# EAGLE design carbsync (EAGLE 7.2.0)
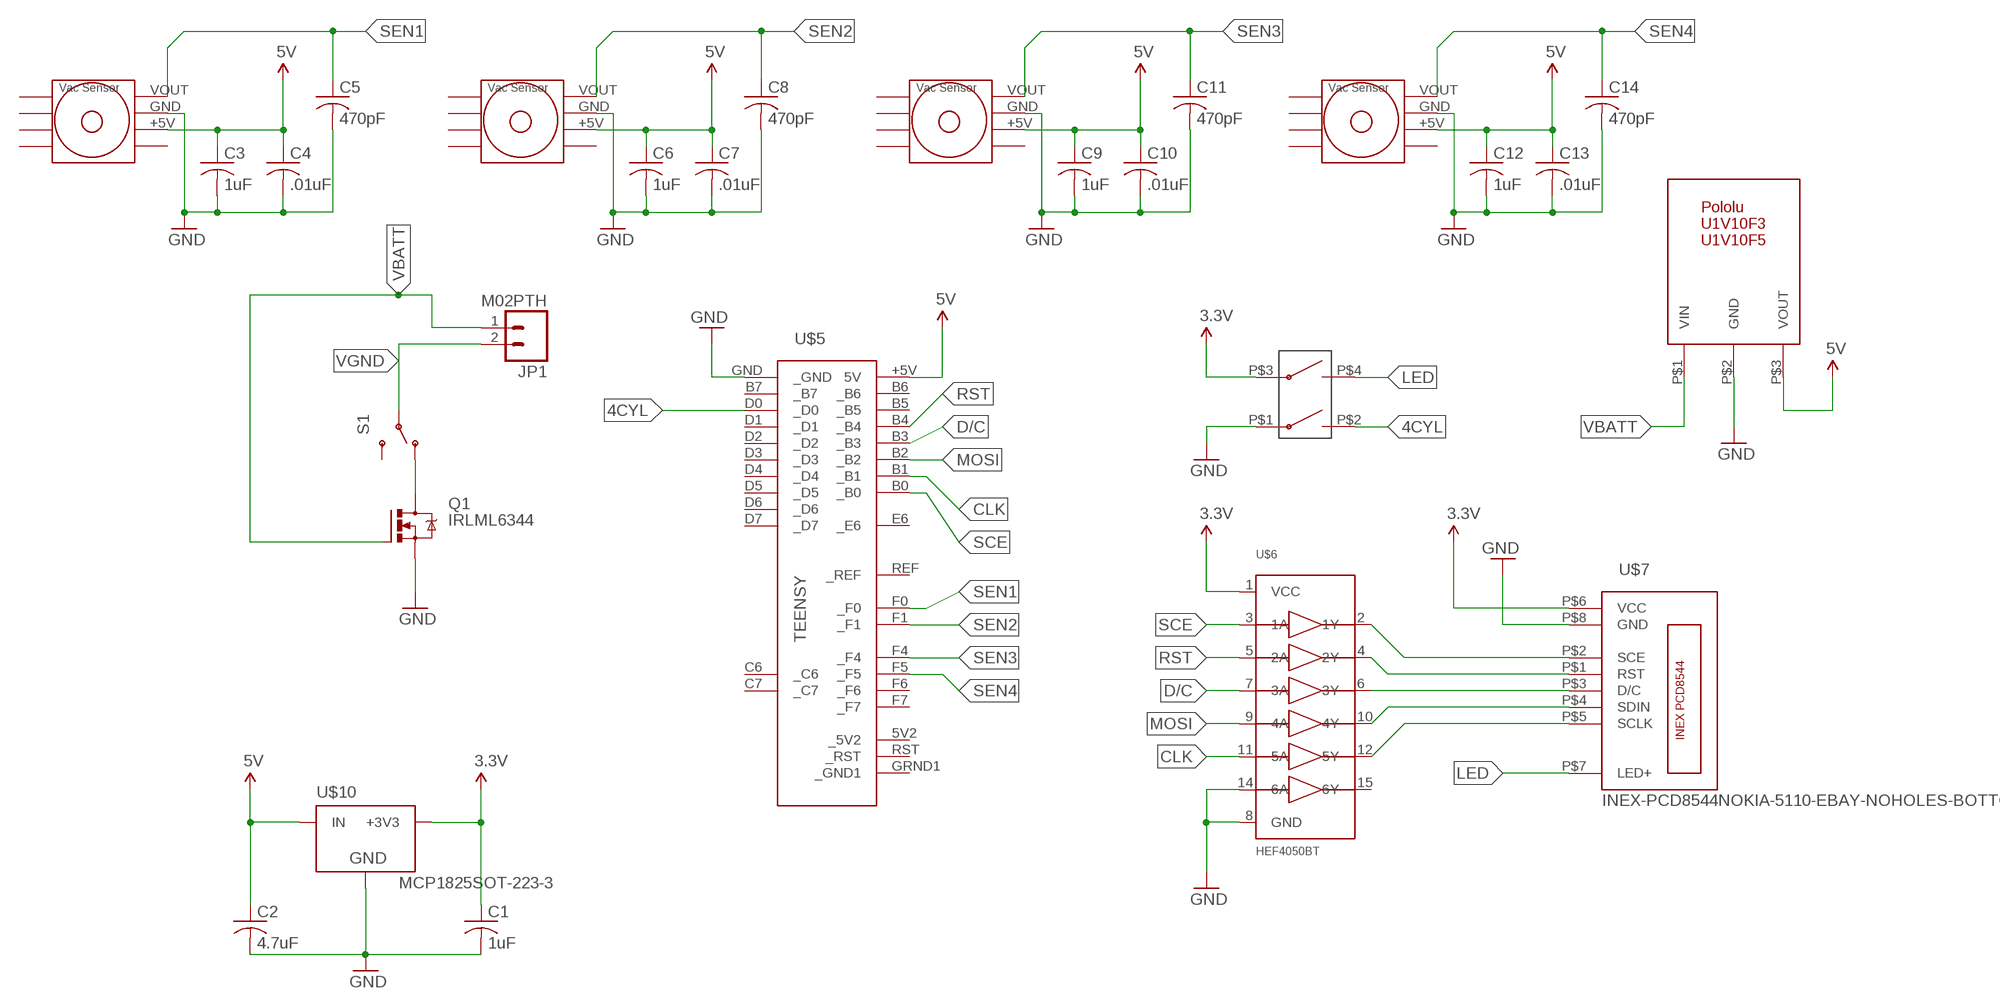
[diagram p0: schematic, sheet 1]

## Parts
C1  1uF  C-USC0805  [C0805]
C2  4.7uF  C-USC0805  [C0805]
C3  1uF  C-USC0805  [C0805]
C4  .01uF  C-USC0805  [C0805]
C5  470pF  C-USC0603  [C0603]
C6  1uF  C-USC0805  [C0805]
C7  .01uF  C-USC0805  [C0805]
C8  470pF  C-USC0603  [C0603]
C9  1uF  C-USC0805  [C0805]
C10  .01uF  C-USC0805  [C0805]
C11  470pF  C-USC0603  [C0603]
C12  1uF  C-USC0805  [C0805]
C13  .01uF  C-USC0805  [C0805]
C14  470pF  C-USC0603  [C0603]
JP1  M02PTH  [1X02]
Q1  IRLML6344  [SOT23]
S1  SWITCH-SPDT  [CWI286-SPDT-NOTABS]
U$1  MPXV5050V  [MPXV5050V]
U$2  MPXV5050V  [MPXV5050V]
U$3  MPXV5050V  [MPXV5050V]
U$4  MPXV5050V  [MPXV5050V]
U$5  TEENSY  [TEENSY]
U$6  HEF4050BT  74HC4050D  [SOIC16]
U$7  INEX-PCD8544NOKIA-5110-EBAY-NOHOLES-BOTTOM  [NOKIA-5110-EBAY-NOHOLES]
U$8  POLOLU-DC-3PINU1V10F5-5V-DC-UP  [POLOLU-DC-3PIN]
U$9  CT-219-X-MST  [CT219-2-MST]
U$10  MCP1825SOT-223-3  [SOT-223]

## Nets
3.3V: C1.1 U$6.1(VCC) U$7.P$6(VCC) U$9.P$3 U$10.3(+3V3)
4CYL: U$5.D0(_D0) U$9.P$2
5V: C2.1 C3.1 C4.1 C6.1 C7.1 C9.1 C10.1 C12.1 C13.1 U$1.+5V(5V) U$2.+5V(5V) U$3.+5V(5V) U$4.+5V(5V) U$5.+5V(5V) U$8.P$3(VOUT) U$10.1(IN)
CLK: U$5.B1(_B1) U$6.11(5A)
D/C: U$5.B3(_B3) U$6.7(3A)
GND: C1.2 C2.2 C3.2 C4.2 C5.2 C6.2 C7.2 C8.2 C9.2 C10.2 C11.2 C12.2 C13.2 C14.2 Q1.2(S) U$1.GND U$2.GND U$3.GND U$4.GND U$5.GND(_GND) U$6.8(GND) U$6.14(6A) U$7.P$8(GND) U$8.P$2(GND) U$9.P$1 U$10.2(GND) U$10.4(GND)
LED: U$7.P$7(LED+) U$9.P$4
MOSI: U$5.B2(_B2) U$6.9(4A)
N$1: U$6.2(1Y) U$7.P$2(SCE)
N$2: U$6.4(2Y) U$7.P$1(RST)
N$3: U$6.6(3Y) U$7.P$3(D/C)
N$4: U$6.10(4Y) U$7.P$4(SDIN)
N$5: U$6.12(5Y) U$7.P$5(SCLK)
N$6: Q1.3(D) S1.P$1(O)
RST: U$5.B4(_B4) U$6.5(2A)
SCE: U$5.B0(_B0) U$6.3(1A)
SEN1: C5.1 U$1.VOUT U$5.F0(_F0)
SEN2: C8.1 U$2.VOUT U$5.F1(_F1)
SEN3: C11.1 U$3.VOUT U$5.F4(_F4)
SEN4: C14.1 U$4.VOUT U$5.F5(_F5)
VBATT: JP1.1 Q1.1(G) U$8.P$1(VIN)
VGND: JP1.2 S1.P$2(P)
Unconnected: S1.P$3(S) U$1.P$1 U$1.P$5 U$1.P$6 U$1.P$7 U$1.P$8 U$2.P$1 U$2.P$5 U$2.P$6 U$2.P$7 U$2.P$8 U$3.P$1 U$3.P$5 U$3.P$6 U$3.P$7 U$3.P$8 U$4.P$1 U$4.P$5 U$4.P$6 U$4.P$7 U$4.P$8 U$5.5V2(_5V2) U$5.B5(_B5) U$5.B6(_B6) U$5.B7(_B7) U$5.C6(_C6) U$5.C7(_C7) U$5.D1(_D1) U$5.D2(_D2) U$5.D3(_D3) U$5.D4(_D4) U$5.D5(_D5) U$5.D6(_D6) U$5.D7(_D7) U$5.E6(_E6) U$5.F6(_F6) U$5.F7(_F7) U$5.GRND1(_GND1) U$5.REF(_REF) U$5.RST(_RST) U$6.15(6Y)

## Library data of the parts
C1-C14 = resistor:C-US: CAPACITOR, American symbol
JP1 = SparkFun-Connectors:M02: Standard 2-pin 0.1" header. Use with - straight break away headers ( PRT-00116) - right angle break away headers (PRT-00553) - swiss pins (PRT-00743) - machine pins (PRT-00117) - female headers (PRT-00115) Molex polarized connector foot print use with: PRT-08233 with associated crimp pins and housings. 2.54_SCREWTERM for use with PRT-10571. 3.5mm Screw Terminal footprints for PRT-08084 5mm Screw Terminal footprints for use with PRT-08433
Q1 = synfinatic:IRLML6344: N-CHANNEL MOS FET
S1 = synfinatic:SWITCH-SPDT: SPDT Switch Simple slide switch, Spark Fun Electronics SKU : COM-00102 DPDT SMT slide switch, AYZ0202, SWCH-08179
U$1-U$4 = synfinatic:MPXV5050V: Freescale Semiconductor MPXV5050VC6T1 Rev 2, 11/2009 Pressure High Temperature Accuracy Integrated Silicon Pressure Sensor for Measuring Absolute Pressure, On-Chip Signal Conditioned, Temperature Compensated and Calibrated
U$5 = teensy:TEENSY: Teensy 2.0 Original Design by Clint Fisher Modified Design by Tamir Emran Licensed Under Creative Commons Attribution-ShareAlike 3.0 Unported (CC BY-SA 3.0)
U$6 = microbuilder:74HC4050D: 6-channel level shifter 74HC4050D - 2V-6V Supply Digikey: 74HC4050D,653-ND Mouser: 771-74HC4050D-T
U$7 = synfinatic:INEX-PCD8544: INEX PCD8544 LCD Basically a Nokia 5110 LCD with 8 pins. Available at Robotshop.com Note that this PCB has two sets of contacts, top has pins, the bottom has through-hole pads. If you want to use the pads on the bottom, use the alternate package
U$8 = synfinatic:POLOLU-DC-3PIN: Pololu 5V Step-Up Voltage Regulator U1V10F5 Pololu 3.3V Step-Up Voltage Regulator U1V10F3
U$9 = synfinatic:CT-219-X-MST
U$10 = synfinatic:MCP1825: MCP1825 3.3v LDO Linear Regulator

## Board
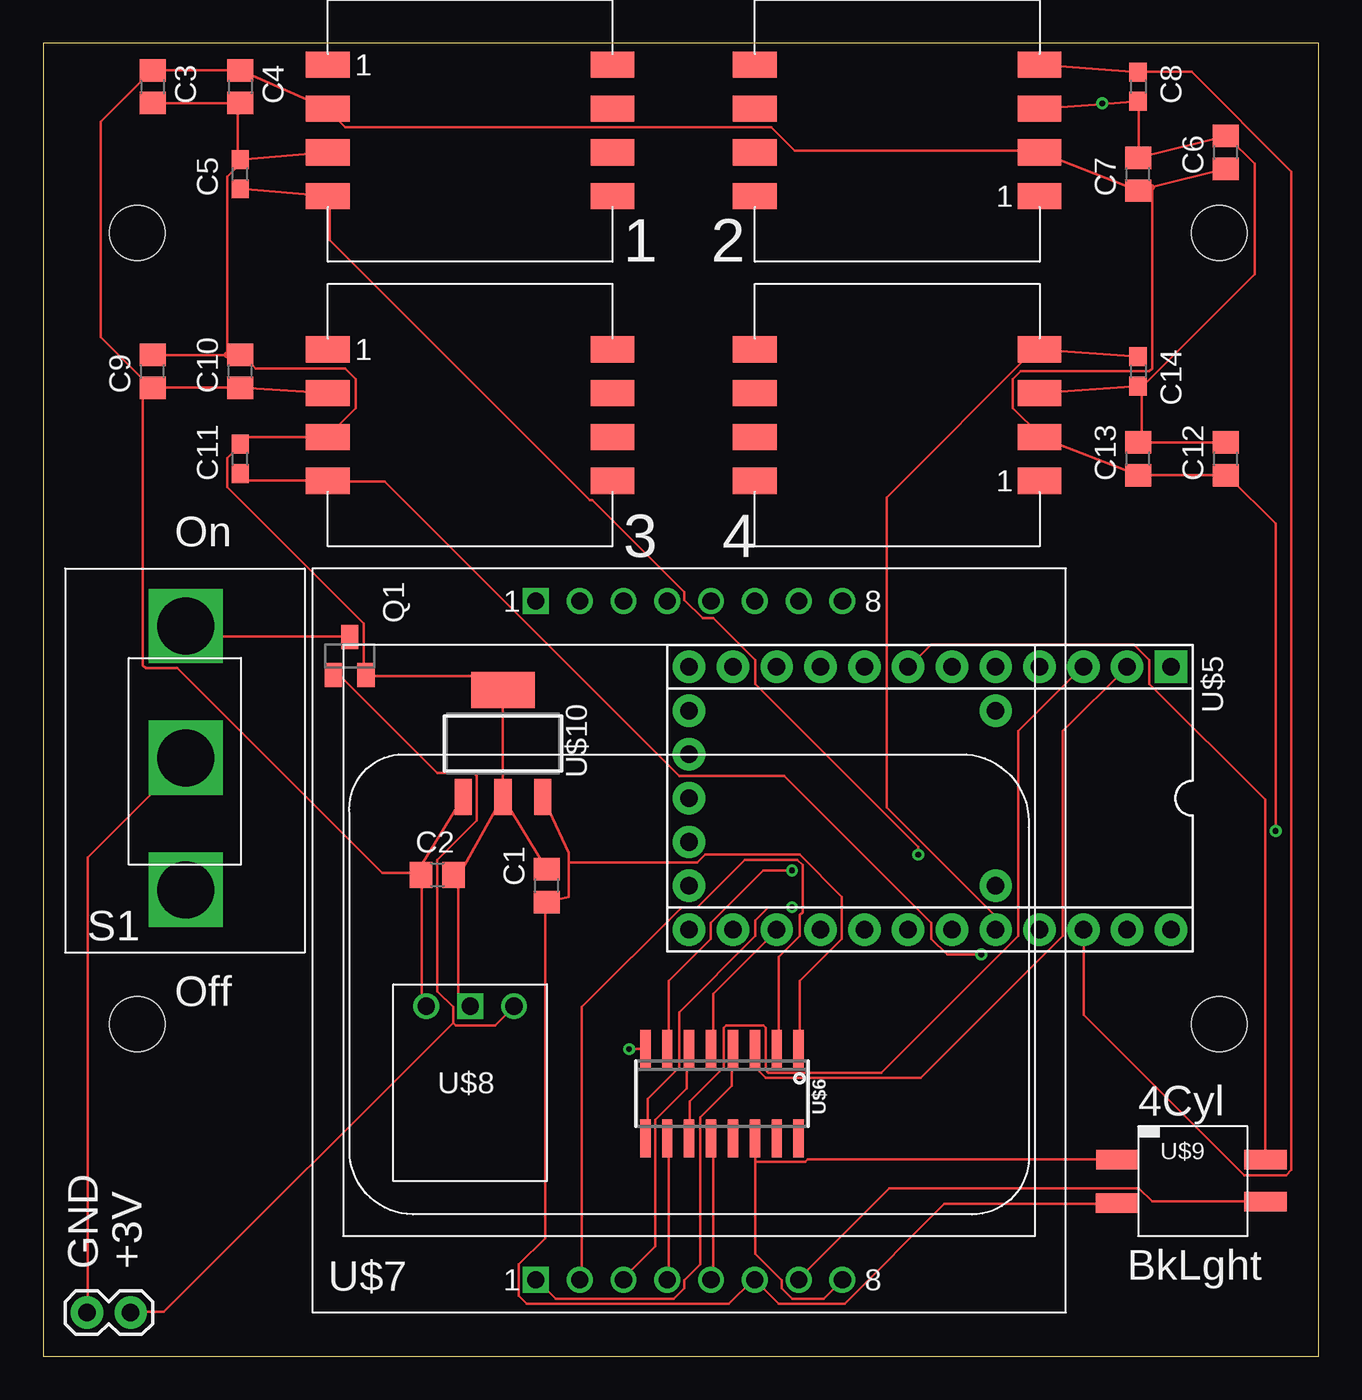
[diagram p1: board, top side]
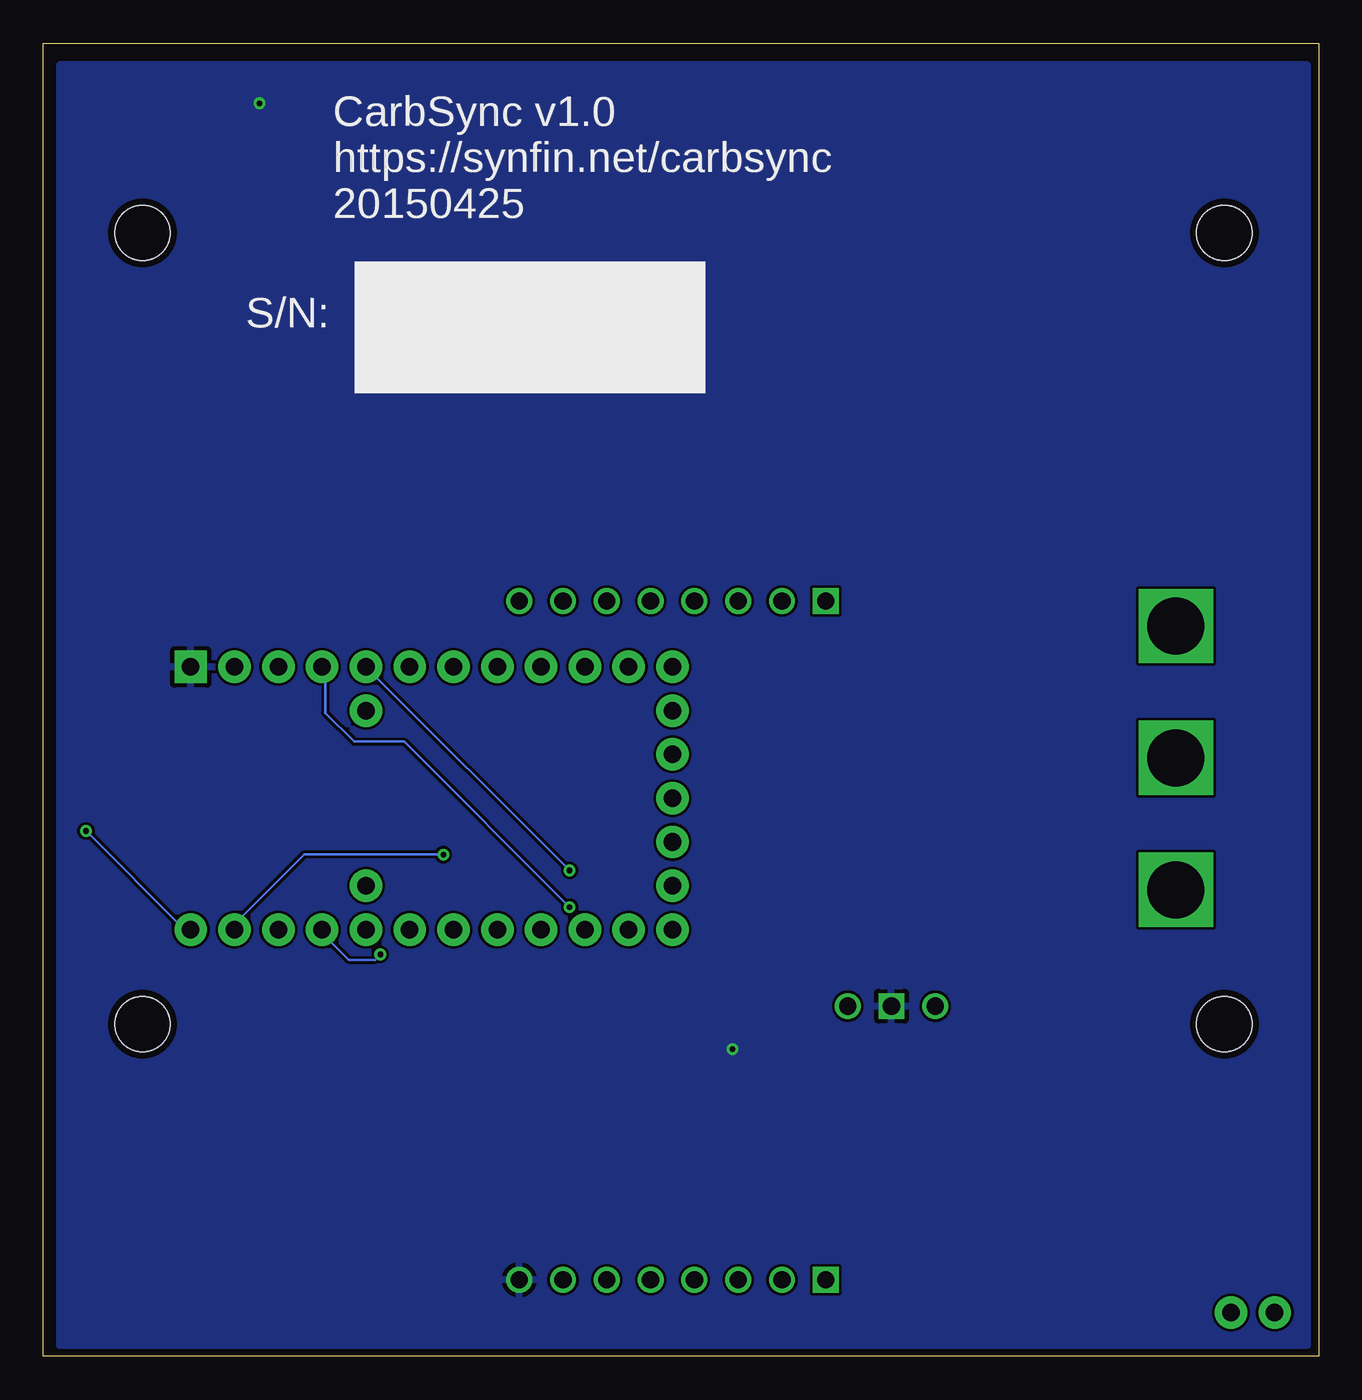
[diagram p2: board, bottom side, seen from below]

Size 73.97 x 76.19 mm. Coordinates in mm from the lower left corner, seen from the top.
Outline: 0,0 73.97,0 73.97,76.19 0,76.19 0,0
Copper layers (1*16): Top 0.0356mm / dielectric 1.5011mm / Bottom 0.0356mm
Design rules "LaenPCBOrder": minimum track width 6mil, minimum drill 13mil, track to track 6mil, track to pad 6mil, pad to pad 6mil, via to via 6mil, smd to smd 6mil, copper to edge 15mil, drill to drill 6mil, minimum pad ring 7mil, minimum via ring 7mil, stop-mask expansion 4mil, vias tented up to drill 0mil, thermal gap 10mil
Holes 3.2 mm at 5.46,19.28 68.2,19.28 68.2,65.18 5.46,65.18

### Footprints (pad centres in the part's own frame; a part is rotated, then mirrored left to right if it is on the bottom)
C0805 = smd 1.3 x 1.5: 1 -0.95,0; 2 0.95,0
C0603 = smd 1.1 x 1: 1 -0.85,0; 2 0.85,0
1X02 = drill 1.016 pad 1.88: 1 0,0; 2 2.54,0
SOT23 = smd 1 x 1.4: 1 -0.95,-1.1; 2 0.95,-1.1; 3 0,1.1
CWI286-SPDT-NOTABS = drill 3.3 square: P$1 3.35,7; P$2 11,7; P$3 18.65,7
MPXV5050V = smd 2.54 x 1.52: +5V 8.255,-1.27; GND 8.255,1.27; P$1 8.255,-3.81; P$5 -8.255,3.81; P$6 -8.255,1.27; P$7 -8.255,-1.27; P$8 -8.255,-3.81; VOUT 8.255,3.81
TEENSY = drill 1.016 pad 1.88: 5V2 13.97,-2.54; +5V -13.97,7.62; B0 -11.43,-7.62; B1 -8.89,-7.62; B2 -6.35,-7.62; B3 -3.81,-7.62; B4 8.89,7.62; B5 6.35,7.62; B6 3.81,7.62; B7 -1.27,-7.62; C6 11.43,-7.62; C7 13.97,-7.62; D0 1.27,-7.62; D1 3.81,-7.62; D2 6.35,-7.62; D3 8.89,-7.62; D4 13.97,5.08; D5 13.97,-5.08; D6 13.97,7.62; D7 11.43,7.62; E6 -3.81,-5.08; F0 -11.43,7.62; F1 -8.89,7.62; F4 -6.35,7.62; F5 -3.81,7.62; F6 -1.27,7.62; F7 1.27,7.62; GRND1 13.97,0; REF -3.81,5.08; RST 13.97,2.54 | drill 1.016 pad 1.88 square: GND -13.97,-7.62
SOIC16 = smd 0.6 x 2.2: 1 -4.445,-2.6; 2 -3.175,-2.6; 3 -1.905,-2.6; 4 -0.635,-2.6; 5 0.635,-2.6; 6 1.905,-2.6; 7 3.175,-2.6; 8 4.445,-2.6; 9 4.445,2.6; 10 3.175,2.6; 11 1.905,2.6; 12 0.635,2.6; 13 -0.635,2.6; 14 -1.905,2.6; 15 -3.175,2.6; 16 -4.445,2.6
NOKIA-5110-EBAY-NOHOLES = drill 1 square: P$1 -8.89,-15.875; P$9 -8.89,23.495 | drill 1: P$2 -6.35,-15.875; P$3 -3.81,-15.875; P$4 -1.27,-15.875; P$5 1.27,-15.875; P$6 3.81,-15.875; P$7 6.35,-15.875; P$8 8.89,-15.875; P$10 -6.35,23.495; P$11 -3.81,23.495; P$12 -1.27,23.495; P$13 1.27,23.495; P$14 3.81,23.495; P$15 6.35,23.495; P$16 8.89,23.495
POLOLU-DC-3PIN = drill 1: P$1 1.905,1.27; P$3 6.985,1.27 | drill 1 square: P$2 4.445,1.27
CT219-2-MST = smd 1.13 x 2.44: P$1 0,-1.2; P$2 0,7.39; P$3 2.53,-1.22; P$4 2.44,7.39
SOT-223 = smd 1 x 2.1: 1 -2.3,-3.1; 2 0,-3.1; 3 2.3,-3.1 | smd 3.7 x 2.1: 4 0,3.1

### Placement (x,y rotation side)
C1  29.21,27.3 90 top
C2  22.86,27.94 0 top
C3  6.35,73.66 270 top
C4  11.43,73.66 270 top
C5  11.43,68.58 90 top
C6  68.58,69.85 90 top
C7  63.5,68.58 90 top
C8  63.5,73.66 270 top
C9  6.35,57.15 90 top
C10  11.43,57.15 90 top
C11  11.43,52.07 90 top
C12  68.58,52.07 90 top
C13  63.5,52.07 90 top
C14  63.5,57.15 270 top
JP1  5.08,2.54 180 top
Q1  17.78,40.64 0 top
S1  1.27,45.72 270 top
U$1  24.77,71.12 180 top
U$2  49.53,71.12 0 top
U$3  24.77,54.61 180 top
U$4  49.53,54.61 0 top
U$5  51.44,32.38 180 top
U$6  39.37,15.24 180 top
U$7  37.47,20.32 0 top
U$8  29.21,21.59 180 top
U$9  63.5,11.43 270 top
U$10  26.67,35.56 0 top

### Tracks (layer width: path | path; a pad name or v marks a point on that pad's centre or on a via)
3.3V
  Top 0.152: U$10.3 30.48,29.21 30.48,28.65 | 30.48,28.65 30.48,26.67 C1.1 29.11,26.21 29.11,6.86 27.58,5.33 27.58,3.5 28.04,3.05 39.78,3.05 41.15,4.42 U$7.P$6 42.67,3.05 46.48,3.05 52.27,8.84 62.18,8.84 U$9.P$3 | 30.48,28.65 37.95,28.65 38.41,29.11 43.89,29.11 46.33,26.67 46.33,24.23 43.89,21.79 43.89,17.98 U$6.1
4CYL
  Top 0.152: U$9.P$2 70.87,11.43 70.87,32.31 64.16,39.01 64.16,40.39 63.25,41.3 51.51,41.3 50.29,40.08 U$5.D0
5V  (via drill 0.33)
  Top 0.152: C7.1 U$2.+5V 57.61,69.95 43.59,69.95 42.22,71.32 17.53,71.32 16.61,72.24 U$1.+5V C4.1 C3.1 6.25,74.52 3.35,71.63 3.35,59.13 6.25,56.24 C9.1 | C9.1 C10.1 U$3.+5V | C6.1 64.27,67.82 64.31,67.67 64.31,57.3 64.16,57.15 56.69,57.15 56.24,56.69 56.24,55.02 57.76,53.49 U$4.+5V C13.1 C12.1 68.73,51.05 71.48,48.31 v71.48,30.48 | U$10.1 21.69,28.1 21.79,28.04 C2.1 | C2.1 21.95,27.89 21.95,20.57 22.1,20.42 U$8.P$3 | C2.1 21.49,28.04 19.66,28.04 7.77,39.93 5.94,39.93 5.79,40.08 5.79,55.63 6.25,56.08 C9.1
  Top 0.406: 64.27,67.82 C7.1 | 21.69,28.1 21.59,27.94
  Bottom 0.152: v71.48,30.48 65.84,24.84 65.53,24.84 U$5.+5V
CLK
  Top 0.152: U$6.11 37.49,12.65 37.49,14.78 39.47,16.76 39.47,19.05 39.62,19.2 41.76,19.2 41.91,19.05 41.91,16.61 42.06,16.46 48.62,16.46 56.54,24.38 56.54,36.27 60.2,39.93 U$5.B1
D/C  (via drill 0.33)
  Top 0.152: v43.43,28.19 41.76,28.19 38.71,25.15 38.71,24.23 36.27,21.79 36.27,17.98 U$6.7
  Bottom 0.152: U$5.B3 v43.43,28.19
GND  (via drill 0.33)
  Top 0.152: C5.2 U$1.GND | U$2.GND 61.42,72.66 | 61.42,72.66 C8.2 63.55,72.69 63.55,69.65 C7.2 C6.2 68.73,70.71 70.26,69.19 70.26,62.79 63.7,56.24 | C3.2 C4.2 11.28,72.54 11.28,69.49 C5.2 | C9.2 10.67,58.1 10.67,68.43 11.28,69.04 11.28,69.34 C5.2 | U$4.GND C14.2 63.7,56.24 | C12.2 C13.2 63.7,53.19 63.7,56.24 | C1.2 U$10.2 | U$10.2 24.16,28 24.08,28.04 23.93,28.04 C2.2 24.08,27.74 24.08,21.03 24.69,20.42 U$8.P$2 | C10.2 11.58,58.06 12.34,57.3 17.53,57.3 18.14,56.69 18.14,55.02 16.61,53.49 U$3.GND 11.43,53.34 C11.2 11.43,52.88 10.67,52.12 10.67,50.44 18.59,42.52 18.59,39.62 Q1.2 18.75,39.47 25.91,39.47 26.67,38.71 U$10.4 U$10.2 | 41.3,11.28 41.3,5.94 42.82,4.42 42.82,3.96 43.43,3.35 45.26,3.35 U$7.P$8 | 41.3,11.28 41.3,12.5 U$6.14 | v33.98,17.83 34.9,17.83 U$6.8 | U$9.P$1 44.35,11.43 44.2,11.28 41.3,11.28 | v61.42,72.69 61.42,72.66
  Top 0.406: C10.2 10.67,58.1 | 24.16,28 24.13,27.94
  pour Bottom: 0.64,74.93 73.03,74.93 73.03,0.64 0.64,0.64
LED
  Top 0.152: U$9.P$4 70.87,8.99 64.31,8.99 63.55,9.75 49.07,9.75 43.89,4.57 U$7.P$7
MOSI  (via drill 0.33)
  Top 0.152: v43.43,26.06 42.06,26.06 41.3,25.3 41.3,24.38 36.88,19.96 36.88,16.76 35.05,14.94 35.05,12.65 U$6.9
  Bottom 0.152: v43.43,26.06 53.03,35.66 55.93,35.66 57.61,37.34 57.61,39.78 57.76,39.93 U$5.B2
N$1
  Top 0.152: U$6.2 42.67,17.98 42.67,23.16 43.89,24.38 43.89,25.6 44.04,25.76 44.04,28.5 43.74,28.8 40.69,28.8 37.95,26.06 37.03,26.06 31.24,20.27 31.24,4.57 U$7.P$2
N$2
  Top 0.152: U$6.4 39.93,17.83 39.93,15.7 38.1,13.87 38.1,5.33 37.19,4.42 37.19,3.96 36.58,3.35 29.72,3.35 28.65,4.42 U$7.P$1
N$3
  Top 0.152: U$6.6 37.34,17.83 37.34,15.54 35.51,13.72 35.51,6.4 33.68,4.57 U$7.P$3
N$4
  Top 0.152: U$6.10 36.27,12.5 36.27,4.57 U$7.P$4
N$5
  Top 0.152: U$6.12 38.86,12.5 38.86,4.57 U$7.P$5
N$6
  Top 0.152: Q1.3 17.68,41.76 8.99,41.76 8.38,42.37 S1.P$1
RST
  Top 0.152: U$6.5 38.86,17.98 38.86,21.03 42.52,24.69 U$5.B4
SCE
  Top 0.152: U$5.B0 59.13,36.27 59.13,24.38 50.9,16.15 41.91,16.15 41.3,16.76 41.3,17.83 U$6.3
SEN1  (via drill 0.33)
  Top 0.152: v50.75,29.11 50.75,29.57 41.3,39.01 41.3,40.39 38.86,42.82 38.25,42.82 37.19,43.89 37.19,44.35 31.85,49.68 31.7,49.68 16.61,64.77 16.61,67.21 U$1.VOUT C5.1
  Bottom 0.152: v50.75,29.11 58.83,29.11 62.79,25.15 62.79,24.84 U$5.F0
SEN2
  Top 0.152: U$2.VOUT C8.1 63.7,74.52 66.6,74.52 72.39,68.73 72.39,10.82 72.08,10.52 69.65,10.52 60.35,19.81 60.35,24.69 U$5.F1
SEN3  (via drill 0.33)
  Top 0.152: C11.1 11.43,50.8 U$3.VOUT 16.61,50.75 19.81,50.75 36.88,33.68 42.98,33.68 51.51,25.15 51.51,24.23 52.43,23.32 v54.41,23.32
  Bottom 0.152: v54.41,23.32 54.71,23.01 56.24,23.01 57.91,24.69 U$5.F4
SEN4
  Top 0.152: C14.1 U$4.VOUT 57.61,58.52 48.92,49.84 48.92,31.85 55.17,25.6 55.17,24.84 U$5.F5
VBATT
  Top 0.152: 23.77,19.36 23.77,20.27 22.86,21.18 22.86,28.8 25.15,31.09 25.15,33.68 24.99,33.83 22.86,33.83 17.22,39.47 16.92,39.47 Q1.1 | 23.77,19.36 23.93,19.2 26.21,19.2 27.28,20.27 U$8.P$1 | 23.77,19.36 7.01,2.59 5.18,2.59 JP1.1
VGND
  Top 0.152: JP1.2 2.59,2.59 2.59,28.96 8.23,34.59 S1.P$2

### Text on the board
tPlace: S1 | U$8 | U$9 | U$7
bPlace: CarbSync v1.0 / https://synfin.net/carbsync / 20150425 | S/N:
tNames: 1 | 2 | On | 3 | 4 | Off | 4Cyl | GND | +3V | BkLght